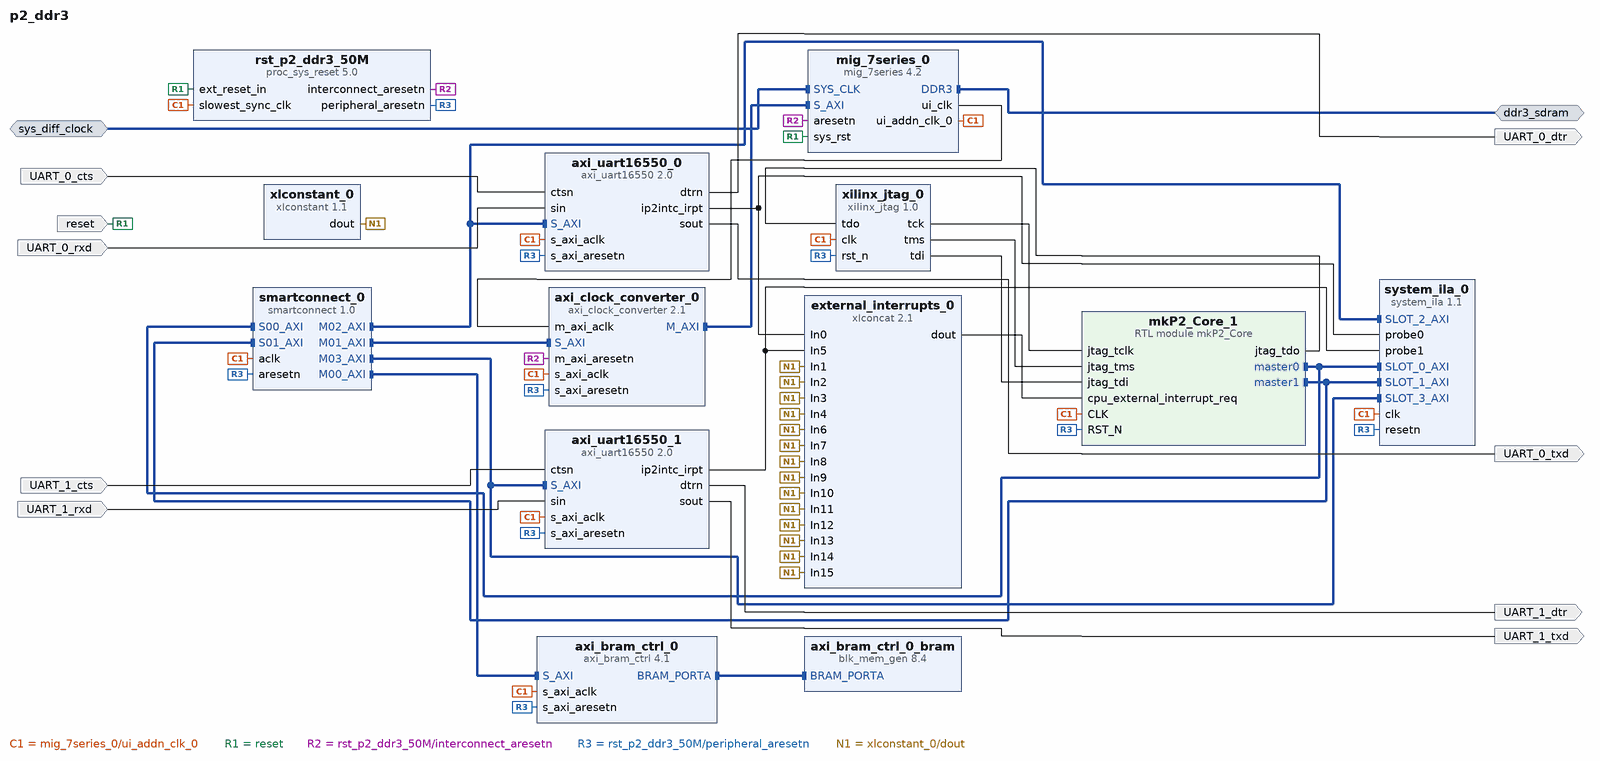
[diagram p0: block diagram of the top level]
# Vivado block design p2_ddr3, xc7z045ffg900-2, Vivado 2022.1
create_bd_design p2_ddr3

create_bd_intf_port -mode Master -vlnv xilinx.com:interface:ddrx_rtl:1.0 ddr3_sdram
create_bd_intf_port -mode Slave -vlnv xilinx.com:interface:diff_clock_rtl:1.0 sys_diff_clock
create_bd_port -dir I -type rst reset
set_property -dict {CONFIG.POLARITY ACTIVE_HIGH} [get_bd_ports reset]
create_bd_port -dir O UART_0_txd
create_bd_port -dir I UART_0_rxd
create_bd_port -dir I UART_0_cts
create_bd_port -dir O UART_0_dtr
create_bd_port -dir O UART_1_txd
create_bd_port -dir O UART_1_dtr
create_bd_port -dir I UART_1_rxd
create_bd_port -dir I UART_1_cts

create_bd_cell -type ip -vlnv xilinx.com:ip:mig_7series:4.2 mig_7series_0
set_property -dict [list \
  CONFIG.BOARD_MIG_PARAM ddr3_sdram \
  CONFIG.MIG_DONT_TOUCH_PARAM Custom \
  CONFIG.RESET_BOARD_INTERFACE reset \
  CONFIG.XML_INPUT_FILE mig_b.prj \
] [get_bd_cells mig_7series_0]
create_bd_cell -type ip -vlnv xilinx.com:ip:axi_bram_ctrl:4.1 axi_bram_ctrl_0
set_property -dict {CONFIG.SINGLE_PORT_BRAM 1} [get_bd_cells axi_bram_ctrl_0]
create_bd_cell -type ip -vlnv xilinx.com:ip:blk_mem_gen:8.4 axi_bram_ctrl_0_bram
set_property -dict [list \
  CONFIG.Coe_File ../../../../../../../../../BESSPIN-GFE_2/bootrom/bootrom.coe \
  CONFIG.Load_Init_File true \
  CONFIG.Memory_Type Single_Port_ROM \
  CONFIG.Port_A_Write_Rate 0 \
] [get_bd_cells axi_bram_ctrl_0_bram]
create_bd_cell -type ip -vlnv xilinx.com:ip:axi_clock_converter:2.1 axi_clock_converter_0
create_bd_cell -type ip -vlnv xilinx.com:ip:axi_uart16550:2.0 axi_uart16550_0
set_property -dict {CONFIG.C_S_AXI_ACLK_FREQ_HZ 50000000} [get_bd_cells axi_uart16550_0]
create_bd_cell -type ip -vlnv xilinx.com:ip:smartconnect:1.0 smartconnect_0
set_property -dict {CONFIG.NUM_MI 4} [get_bd_cells smartconnect_0]
create_bd_cell -type ip -vlnv ssith:user:xilinx_jtag:1.0 xilinx_jtag_0
create_bd_cell -type module -reference mkP2_Core mkP2_Core_1
create_bd_cell -type ip -vlnv xilinx.com:ip:system_ila:1.1 system_ila_0
set_property -dict [list \
  CONFIG.C_MON_TYPE MIX \
  CONFIG.C_NUM_MONITOR_SLOTS 4 \
  CONFIG.C_NUM_OF_PROBES 2 \
  CONFIG.C_PROBE0_TYPE 0 \
  CONFIG.C_PROBE1_TYPE 0 \
  CONFIG.C_SLOT_0_APC_EN 0 \
  CONFIG.C_SLOT_0_AXI_AR_SEL_DATA 1 \
  CONFIG.C_SLOT_0_AXI_AR_SEL_TRIG 1 \
  CONFIG.C_SLOT_0_AXI_AW_SEL_DATA 1 \
  CONFIG.C_SLOT_0_AXI_AW_SEL_TRIG 1 \
  CONFIG.C_SLOT_0_AXI_B_SEL_DATA 1 \
  CONFIG.C_SLOT_0_AXI_B_SEL_TRIG 1 \
  CONFIG.C_SLOT_0_AXI_R_SEL_DATA 1 \
  CONFIG.C_SLOT_0_AXI_R_SEL_TRIG 1 \
  CONFIG.C_SLOT_0_AXI_W_SEL_DATA 1 \
  CONFIG.C_SLOT_0_AXI_W_SEL_TRIG 1 \
  CONFIG.C_SLOT_0_INTF_TYPE xilinx.com:interface:aximm_rtl:1.0 \
  CONFIG.C_SLOT_1_APC_EN 0 \
  CONFIG.C_SLOT_1_AXI_AR_SEL_DATA 1 \
  CONFIG.C_SLOT_1_AXI_AR_SEL_TRIG 1 \
  CONFIG.C_SLOT_1_AXI_AW_SEL_DATA 1 \
  CONFIG.C_SLOT_1_AXI_AW_SEL_TRIG 1 \
  CONFIG.C_SLOT_1_AXI_B_SEL_DATA 1 \
  CONFIG.C_SLOT_1_AXI_B_SEL_TRIG 1 \
  CONFIG.C_SLOT_1_AXI_R_SEL_DATA 1 \
  CONFIG.C_SLOT_1_AXI_R_SEL_TRIG 1 \
  CONFIG.C_SLOT_1_AXI_W_SEL_DATA 1 \
  CONFIG.C_SLOT_1_AXI_W_SEL_TRIG 1 \
  CONFIG.C_SLOT_1_INTF_TYPE xilinx.com:interface:aximm_rtl:1.0 \
  CONFIG.C_SLOT_2_APC_EN 0 \
  CONFIG.C_SLOT_2_AXI_AR_SEL_DATA 1 \
  CONFIG.C_SLOT_2_AXI_AR_SEL_TRIG 1 \
  CONFIG.C_SLOT_2_AXI_AW_SEL_DATA 1 \
  CONFIG.C_SLOT_2_AXI_AW_SEL_TRIG 1 \
  CONFIG.C_SLOT_2_AXI_B_SEL_DATA 1 \
  CONFIG.C_SLOT_2_AXI_B_SEL_TRIG 1 \
  CONFIG.C_SLOT_2_AXI_R_SEL_DATA 1 \
  CONFIG.C_SLOT_2_AXI_R_SEL_TRIG 1 \
  CONFIG.C_SLOT_2_AXI_W_SEL_DATA 1 \
  CONFIG.C_SLOT_2_AXI_W_SEL_TRIG 1 \
  CONFIG.C_SLOT_2_INTF_TYPE xilinx.com:interface:aximm_rtl:1.0 \
  CONFIG.C_SLOT_3_APC_EN 0 \
  CONFIG.C_SLOT_3_AXI_AR_SEL_DATA 1 \
  CONFIG.C_SLOT_3_AXI_AR_SEL_TRIG 1 \
  CONFIG.C_SLOT_3_AXI_AW_SEL_DATA 1 \
  CONFIG.C_SLOT_3_AXI_AW_SEL_TRIG 1 \
  CONFIG.C_SLOT_3_AXI_B_SEL_DATA 1 \
  CONFIG.C_SLOT_3_AXI_B_SEL_TRIG 1 \
  CONFIG.C_SLOT_3_AXI_R_SEL_DATA 1 \
  CONFIG.C_SLOT_3_AXI_R_SEL_TRIG 1 \
  CONFIG.C_SLOT_3_AXI_W_SEL_DATA 1 \
  CONFIG.C_SLOT_3_AXI_W_SEL_TRIG 1 \
  CONFIG.C_SLOT_3_INTF_TYPE xilinx.com:interface:aximm_rtl:1.0 \
] [get_bd_cells system_ila_0]
create_bd_cell -type ip -vlnv xilinx.com:ip:proc_sys_reset:5.0 rst_p2_ddr3_50M
create_bd_cell -type ip -vlnv xilinx.com:ip:xlconcat:2.1 external_interrupts_0
set_property -dict {CONFIG.NUM_PORTS 16} [get_bd_cells external_interrupts_0]
create_bd_cell -type ip -vlnv xilinx.com:ip:axi_uart16550:2.0 axi_uart16550_1
create_bd_cell -type ip -vlnv xilinx.com:ip:xlconstant:1.1 xlconstant_0
set_property -dict {CONFIG.CONST_VAL 0} [get_bd_cells xlconstant_0]

# ---- connections ----

connect_bd_intf_net [get_bd_intf_pins axi_bram_ctrl_0_bram/BRAM_PORTA] [get_bd_intf_pins axi_bram_ctrl_0/BRAM_PORTA]
connect_bd_intf_net [get_bd_intf_pins axi_clock_converter_0/M_AXI] [get_bd_intf_pins mig_7series_0/S_AXI]
connect_bd_intf_net [get_bd_intf_ports ddr3_sdram] [get_bd_intf_pins mig_7series_0/DDR3]
connect_bd_intf_net -intf_net mkP2_Core_0_master0 [get_bd_intf_pins smartconnect_0/S00_AXI] [get_bd_intf_pins mkP2_Core_1/master0]
connect_bd_intf_net [get_bd_intf_pins smartconnect_0/S00_AXI] [get_bd_intf_pins system_ila_0/SLOT_0_AXI]
connect_bd_intf_net -intf_net mkP2_Core_0_master1 [get_bd_intf_pins smartconnect_0/S01_AXI] [get_bd_intf_pins mkP2_Core_1/master1]
connect_bd_intf_net [get_bd_intf_pins smartconnect_0/S01_AXI] [get_bd_intf_pins system_ila_0/SLOT_1_AXI]
connect_bd_intf_net [get_bd_intf_pins smartconnect_0/M00_AXI] [get_bd_intf_pins axi_bram_ctrl_0/S_AXI]
connect_bd_intf_net [get_bd_intf_pins axi_clock_converter_0/S_AXI] [get_bd_intf_pins smartconnect_0/M01_AXI]
connect_bd_intf_net -intf_net smartconnect_0_M02_AXI [get_bd_intf_pins smartconnect_0/M02_AXI] [get_bd_intf_pins axi_uart16550_0/S_AXI]
connect_bd_intf_net [get_bd_intf_pins smartconnect_0/M02_AXI] [get_bd_intf_pins system_ila_0/SLOT_2_AXI]
connect_bd_intf_net -intf_net smartconnect_0_M03_AXI [get_bd_intf_pins smartconnect_0/M03_AXI] [get_bd_intf_pins axi_uart16550_1/S_AXI]
connect_bd_intf_net [get_bd_intf_pins smartconnect_0/M03_AXI] [get_bd_intf_pins system_ila_0/SLOT_3_AXI]
connect_bd_intf_net [get_bd_intf_ports sys_diff_clock] [get_bd_intf_pins mig_7series_0/SYS_CLK]
connect_bd_net [get_bd_pins mig_7series_0/ui_addn_clk_0] \
  [get_bd_pins axi_bram_ctrl_0/s_axi_aclk] [get_bd_pins axi_clock_converter_0/s_axi_aclk] [get_bd_pins smartconnect_0/aclk] \
  [get_bd_pins xilinx_jtag_0/clk] [get_bd_pins mkP2_Core_1/CLK] [get_bd_pins axi_uart16550_0/s_axi_aclk] \
  [get_bd_pins system_ila_0/clk] [get_bd_pins rst_p2_ddr3_50M/slowest_sync_clk] [get_bd_pins axi_uart16550_1/s_axi_aclk]
connect_bd_net [get_bd_ports UART_0_cts] [get_bd_pins axi_uart16550_0/ctsn]
connect_bd_net [get_bd_ports UART_0_rxd] [get_bd_pins axi_uart16550_0/sin]
connect_bd_net [get_bd_ports UART_1_cts] [get_bd_pins axi_uart16550_1/ctsn]
connect_bd_net [get_bd_ports UART_1_rxd] [get_bd_pins axi_uart16550_1/sin]
connect_bd_net [get_bd_pins axi_uart16550_0/dtrn] [get_bd_ports UART_0_dtr]
connect_bd_net -net axi_uart16550_0_ip2intc_irpt [get_bd_pins axi_uart16550_0/ip2intc_irpt] \
  [get_bd_pins system_ila_0/probe0] [get_bd_pins external_interrupts_0/In0]
connect_bd_net [get_bd_pins axi_uart16550_0/sout] [get_bd_ports UART_0_txd]
connect_bd_net [get_bd_pins axi_uart16550_1/dtrn] [get_bd_ports UART_1_dtr]
connect_bd_net -net axi_uart16550_1_ip2intc_irpt [get_bd_pins axi_uart16550_1/ip2intc_irpt] \
  [get_bd_pins external_interrupts_0/In5] [get_bd_pins system_ila_0/probe1]
connect_bd_net [get_bd_pins axi_uart16550_1/sout] [get_bd_ports UART_1_txd]
connect_bd_net -net jtag_clk_1 [get_bd_pins xilinx_jtag_0/tck] [get_bd_pins mkP2_Core_1/jtag_tclk]
connect_bd_net -net jtag_tms_1 [get_bd_pins xilinx_jtag_0/tms] [get_bd_pins mkP2_Core_1/jtag_tms]
connect_bd_net [get_bd_pins mig_7series_0/ui_clk] [get_bd_pins axi_clock_converter_0/m_axi_aclk]
connect_bd_net [get_bd_pins mkP2_Core_1/jtag_tdo] [get_bd_pins xilinx_jtag_0/tdo]
connect_bd_net [get_bd_ports reset] [get_bd_pins mig_7series_0/sys_rst] [get_bd_pins rst_p2_ddr3_50M/ext_reset_in]
connect_bd_net [get_bd_pins rst_p2_ddr3_50M/interconnect_aresetn] \
  [get_bd_pins mig_7series_0/aresetn] [get_bd_pins axi_clock_converter_0/m_axi_aresetn]
connect_bd_net [get_bd_pins rst_p2_ddr3_50M/peripheral_aresetn] \
  [get_bd_pins system_ila_0/resetn] [get_bd_pins axi_bram_ctrl_0/s_axi_aresetn] [get_bd_pins xilinx_jtag_0/rst_n] \
  [get_bd_pins mkP2_Core_1/RST_N] [get_bd_pins smartconnect_0/aresetn] [get_bd_pins axi_uart16550_0/s_axi_aresetn] \
  [get_bd_pins axi_clock_converter_0/s_axi_aresetn] [get_bd_pins axi_uart16550_1/s_axi_aresetn]
connect_bd_net [get_bd_pins xilinx_jtag_0/tdi] [get_bd_pins mkP2_Core_1/jtag_tdi]
connect_bd_net -net xlconcat_0_dout [get_bd_pins external_interrupts_0/dout] [get_bd_pins mkP2_Core_1/cpu_external_interrupt_req]
connect_bd_net [get_bd_pins xlconstant_0/dout] \
  [get_bd_pins external_interrupts_0/In1] [get_bd_pins external_interrupts_0/In2] [get_bd_pins external_interrupts_0/In3] \
  [get_bd_pins external_interrupts_0/In4] [get_bd_pins external_interrupts_0/In6] [get_bd_pins external_interrupts_0/In7] \
  [get_bd_pins external_interrupts_0/In8] [get_bd_pins external_interrupts_0/In9] [get_bd_pins external_interrupts_0/In10] \
  [get_bd_pins external_interrupts_0/In11] [get_bd_pins external_interrupts_0/In12] [get_bd_pins external_interrupts_0/In13] \
  [get_bd_pins external_interrupts_0/In14] [get_bd_pins external_interrupts_0/In15]
set_property HDL_ATTRIBUTE.DEBUG true [get_bd_intf_nets mkP2_Core_0_master0]
set_property HDL_ATTRIBUTE.MARK_DEBUG true [get_bd_intf_nets mkP2_Core_0_master0]
set_property HDL_ATTRIBUTE.DEBUG true [get_bd_intf_nets mkP2_Core_0_master1]
set_property HDL_ATTRIBUTE.MARK_DEBUG true [get_bd_intf_nets mkP2_Core_0_master1]
set_property HDL_ATTRIBUTE.DEBUG true [get_bd_intf_nets smartconnect_0_M02_AXI]
set_property HDL_ATTRIBUTE.MARK_DEBUG true [get_bd_intf_nets smartconnect_0_M02_AXI]
set_property HDL_ATTRIBUTE.DEBUG true [get_bd_intf_nets smartconnect_0_M03_AXI]
set_property HDL_ATTRIBUTE.MARK_DEBUG true [get_bd_intf_nets smartconnect_0_M03_AXI]
set_property HDL_ATTRIBUTE.DEBUG true [get_bd_nets axi_uart16550_0_ip2intc_irpt]
set_property HDL_ATTRIBUTE.MARK_DEBUG true [get_bd_nets axi_uart16550_0_ip2intc_irpt]
set_property HDL_ATTRIBUTE.DEBUG true [get_bd_nets axi_uart16550_1_ip2intc_irpt]
set_property HDL_ATTRIBUTE.MARK_DEBUG true [get_bd_nets axi_uart16550_1_ip2intc_irpt]

# ---- address map ----
assign_bd_address -offset 0x0000000062300000 -range 4K -target_address_space [get_bd_addr_spaces mkP2_Core_1/master0] [get_bd_addr_segs axi_uart16550_0/S_AXI/Reg]
assign_bd_address -offset 0x0000000062340000 -range 4K -target_address_space [get_bd_addr_spaces mkP2_Core_1/master0] [get_bd_addr_segs axi_uart16550_1/S_AXI/Reg]
assign_bd_address -offset 0x0000000070000000 -range 4K -target_address_space [get_bd_addr_spaces mkP2_Core_1/master0] [get_bd_addr_segs axi_bram_ctrl_0/S_AXI/Mem0]
assign_bd_address -offset 0x00000000C0000000 -range 1G -target_address_space [get_bd_addr_spaces mkP2_Core_1/master0] [get_bd_addr_segs mig_7series_0/memmap/memaddr]
assign_bd_address -offset 0x0000000062300000 -range 4K -target_address_space [get_bd_addr_spaces mkP2_Core_1/master1] [get_bd_addr_segs axi_uart16550_0/S_AXI/Reg]
assign_bd_address -offset 0x0000000062340000 -range 4K -target_address_space [get_bd_addr_spaces mkP2_Core_1/master1] [get_bd_addr_segs axi_uart16550_1/S_AXI/Reg]
assign_bd_address -offset 0x0000000070000000 -range 4K -target_address_space [get_bd_addr_spaces mkP2_Core_1/master1] [get_bd_addr_segs axi_bram_ctrl_0/S_AXI/Mem0]
assign_bd_address -offset 0x00000000C0000000 -range 1G -target_address_space [get_bd_addr_spaces mkP2_Core_1/master1] [get_bd_addr_segs mig_7series_0/memmap/memaddr]

validate_bd_design
save_bd_design
